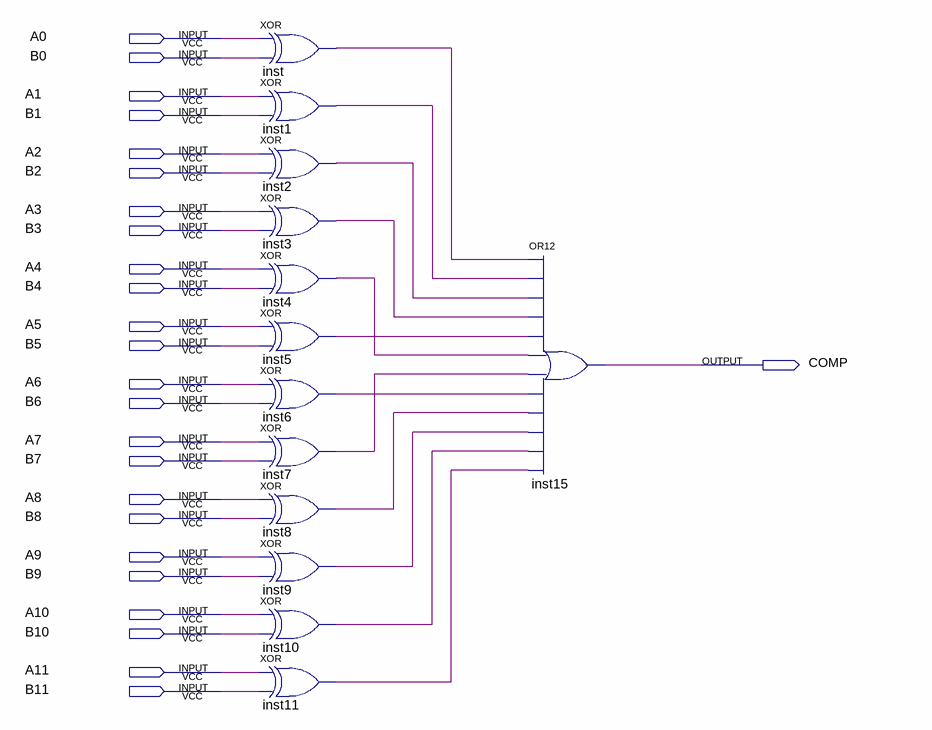
[diagram p0: schematic sheet]
// Quartus schematic Compare_12.bdf as structural Verilog: 13 symbols, 25 pins
module Compare_12 (
  input  A0,
  input  B0,
  input  A1,
  input  B1,
  input  A2,
  input  B2,
  input  A3,
  input  B3,
  input  A4,
  input  B4,
  input  A5,
  input  B5,
  input  A6,
  input  B6,
  input  A7,
  input  B7,
  input  A8,
  input  B8,
  input  A9,
  input  B9,
  input  A10,
  input  B10,
  input  A11,
  input  B11,
  output COMP
);

  wire inst1_out, inst2_out, inst3_out, inst4_out, inst5_out, inst6_out, inst7_out, inst8_out, inst9_out,
       inst10_out, inst11_out, inst_out;

  xor inst (inst_out, A0, B0);
  xor inst1 (inst1_out, A1, B1);
  xor inst2 (inst2_out, A2, B2);
  xor inst3 (inst3_out, A3, B3);
  xor inst4 (inst4_out, A4, B4);
  xor inst5 (inst5_out, A5, B5);
  xor inst6 (inst6_out, A6, B6);
  xor inst7 (inst7_out, A7, B7);
  xor inst8 (inst8_out, A8, B8);
  xor inst9 (inst9_out, A9, B9);
  xor inst10 (inst10_out, A10, B10);
  xor inst11 (inst11_out, A11, B11);
  or inst15 (COMP, inst_out, inst1_out, inst2_out, inst3_out, inst5_out, inst4_out, inst7_out, inst6_out, inst8_out, inst9_out, inst10_out, inst11_out);
endmodule
